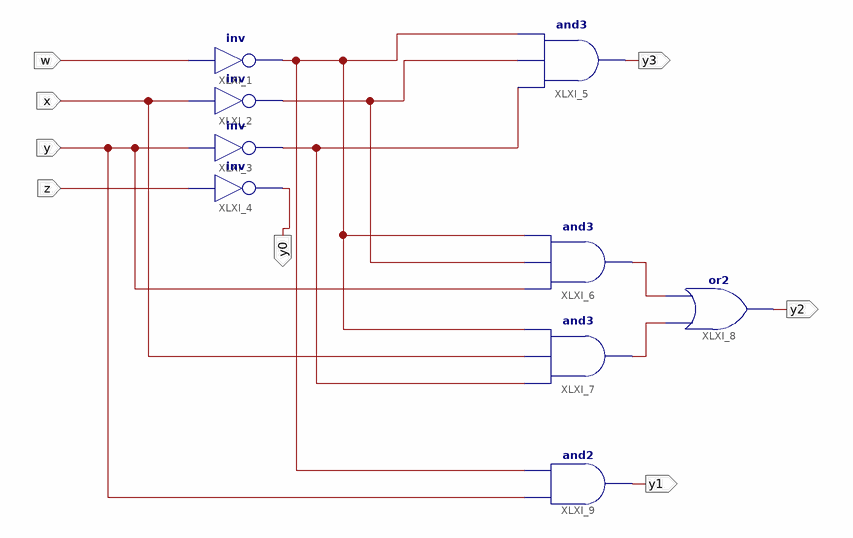
[diagram p0: schematic sheet 1]
// Xilinx ISE schematic sch.sch (artix7) as structural Verilog: 9 symbols, 8 ports
module sch (
  input  w,
  input  x,
  input  y,
  input  z,
  output y3,
  output y2,
  output y1,
  output y0
);

  wire XLXN_12, XLXN_17, XLXN_18, XLXN_19, XLXN_21;

  not XLXI_1 (XLXN_21, w);
  not XLXI_2 (XLXN_12, x);
  not XLXI_3 (XLXN_17, y);
  not XLXI_4 (y0, z);
  and XLXI_5 (y3, XLXN_17, XLXN_12, XLXN_21);
  and XLXI_6 (XLXN_18, y, XLXN_12, XLXN_21);
  and XLXI_7 (XLXN_19, XLXN_17, x, XLXN_21);
  or XLXI_8 (y2, XLXN_19, XLXN_18);
  and XLXI_9 (y1, y, XLXN_21);
endmodule
